# Altium schematic sheet processor.SchDoc
size A4
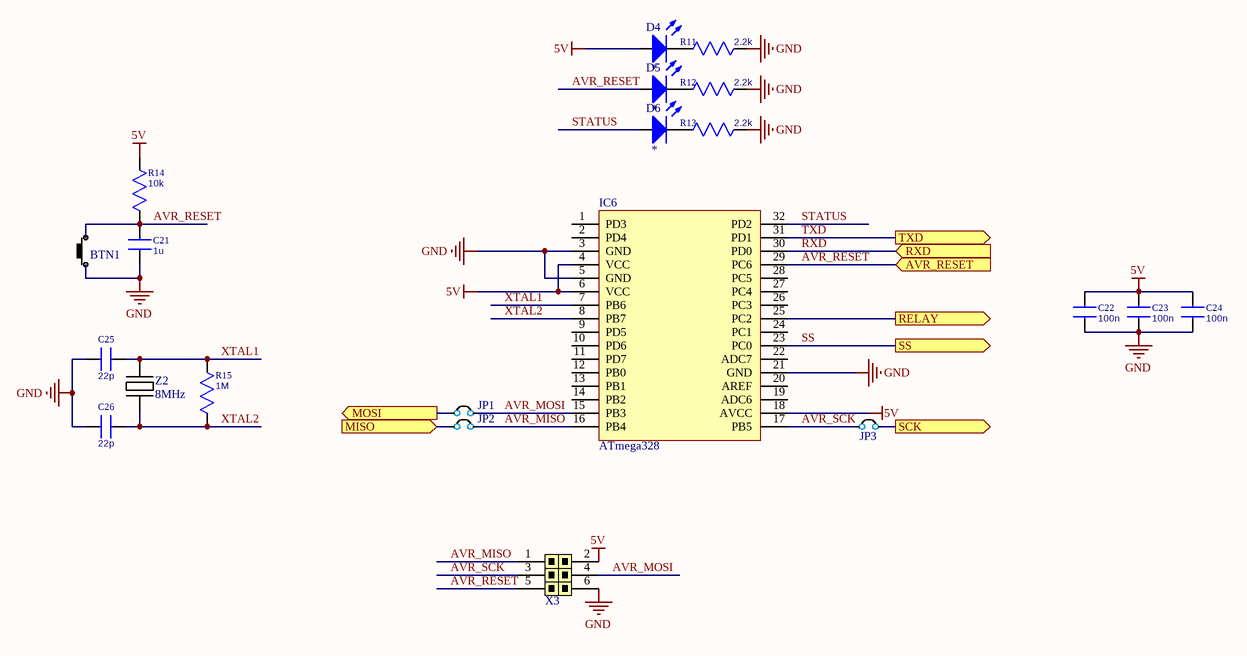
[diagram p0: processor.SchDoc]

## Parts
BTN1  Push Button  [PUSH BUTTON RIGHT ANGLE]  (value not drawn)
C21  1u  [C_0603]
C22  100n  [C_0603]
C23  100n  [C_0603]
C24  100n  [C_0603]
C25  22p  [C_0603]
C26  22p  [C_0603]
D4  *  [LED_5mm]
D5  *  [LED_5mm]
D6  *  [LED_5mm]
IC6  ATmega328  [TQFP-32]
JP1  PLS-2  [PLS-2]  (value not drawn)
JP2  PLS-2  [PLS-2]  (value not drawn)
JP3  PLS-2  [PLS-2]  (value not drawn)
R11  2.2k  [R_0603]
R12  2.2k  [R_0603]
R13  2.2k  [R_0603]
R14  10k  [R_0603]
R15  1M  [R_0603]
X3  PLD-6  [PLD-6]  (value not drawn)
Z2  8MHz  [HC-49]

## Ports
AVR_RESET (in), MISO (in), MOSI (out), RELAY (out), RXD (in), SCK (out), SS (out), TXD (out)

## Nets
5V: C22.2 C23.2 C24.2 D4.1(A) IC6.4(VCC) IC6.6(VCC) IC6.18(AVCC) R14.1 X3.2
GND: BTN1.2 C21.1 C22.1 C23.1 C24.1 C25.2 C26.2 IC6.3(GND) IC6.5(GND) IC6.21(GND) R11.2 R12.2 R13.2 X3.6
AVR_MISO: IC6.16(PB4) JP2.2 X3.1
AVR_MOSI: IC6.15(PB3) JP1.2 X3.4
AVR_RESET: BTN1.1 C21.2 D5.1(A) IC6.29(PC6) R14.2 X3.5 ; port AVR_RESET
AVR_SCK: IC6.17(PB5) JP3.1 X3.3
MISO: JP2.1 ; port MISO
MOSI: JP1.1 ; port MOSI
RELAY: IC6.25(PC2) ; port RELAY
RXD: IC6.30(PD0) ; port RXD
SCK: JP3.2 ; port SCK
SS: IC6.23(PC0) ; port SS
STATUS: D6.1(A) IC6.32(PD2)
TXD: IC6.31(PD1) ; port TXD
XTAL1: C25.1 IC6.7(PB6) R15.1 Z2.2
XTAL2: C26.1 IC6.8(PB7) R15.2 Z2.1
NetD4_2: D4.2(K) R11.1
NetD5_2: D5.2(K) R12.1
NetD6_2: D6.2(K) R13.1

Not connected (* = marked no-connect by the designer): IC6 1(PD3) 2(PD4) 9(PD5) 10(PD6) 11(PD7) 12(PB0) 13(PB1) 14(PB2) 19(ADC6) 20(AREF) 22(ADC7) 24(PC1) 26(PC3) 27(PC4) 28(PC5)

## Library data of the parts
C21-C26 = C0603: Capacitor
  C21: Value: 1u
  C22-C24: Value: 100n
  C25 C26: Value: 22p
D4-D6 = LED_5mm: Typical INFRARED GaAs LED; Value: *; Color: *
IC6 = ATmega328: High Performance, Low Power Atmel AVR 8-Bit Microcontroller
JP1-JP3 = JP-2: Jumper Pins; Type: PLS-2
R11-R15 = R0603: Resistor
  R11-R13: Value: 2.2k
  R14: Value: 10k
  R15: Value: 1M
Z2 = XTAL: Quartz resonator